# Altium project Digital_Azan_Clock.PrjPcb
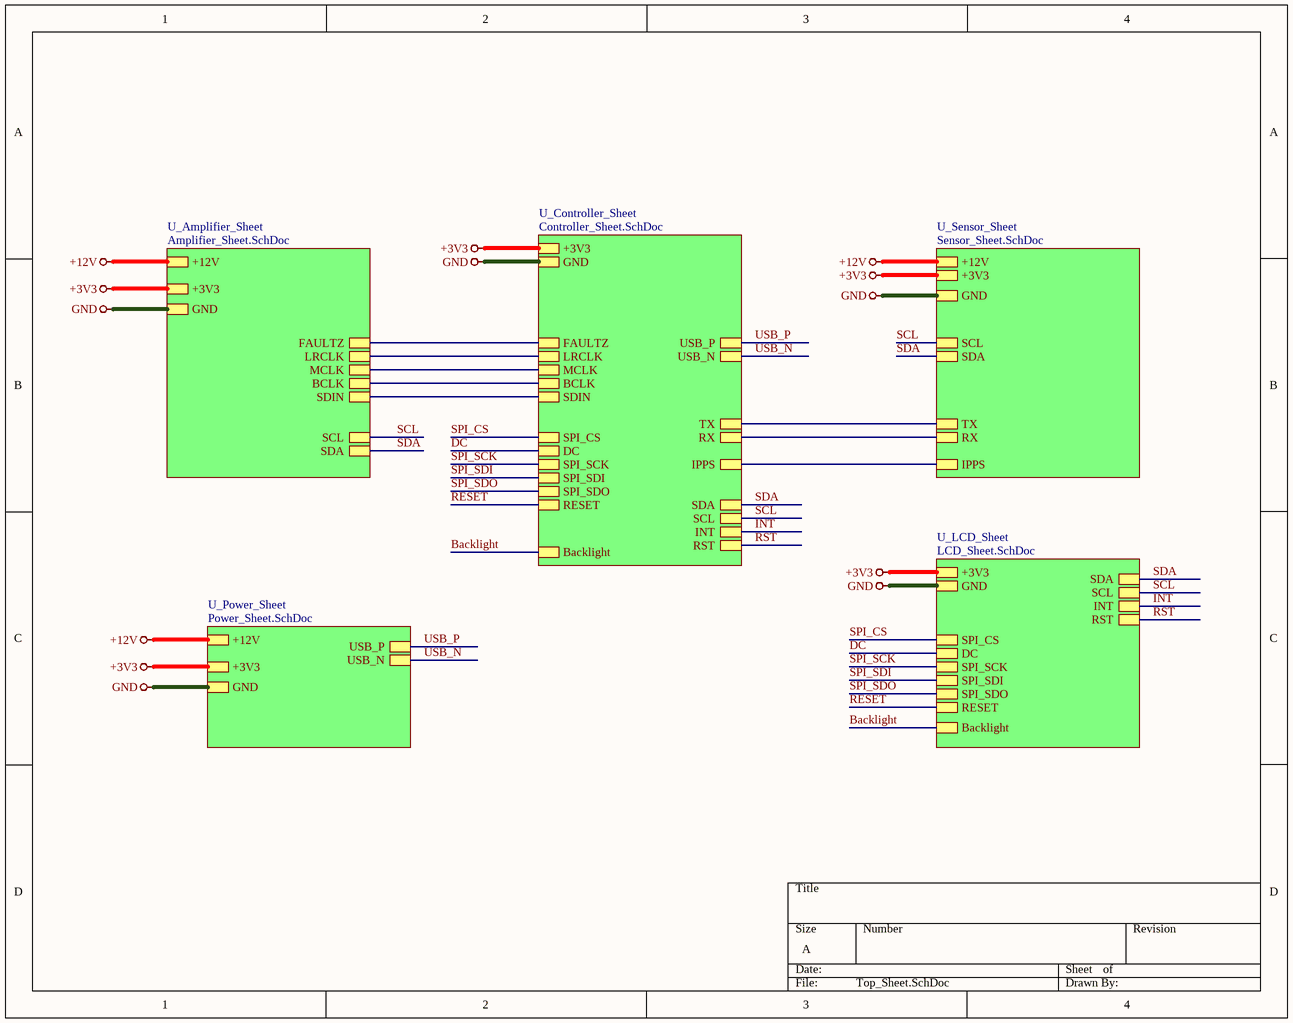
[diagram p0: Top_Sheet.SchDoc]
3 sheets, 41 parts. Net scope: hierarchical (ports join the sheet entries above them; power ports are global).
Board file: Clock-v1.0.PcbDoc
Sheets:
  Top_Sheet.SchDoc
    U_LCD_Sheet = LCD_Sheet.SchDoc
    U_Controller_Sheet = Controller_Sheet.SchDoc

## Sheet Top_Sheet.SchDoc
size A; SheetNumber: 1; SheetTotal: 6

### Sub-sheets
U_Amplifier_Sheet = Amplifier_Sheet.SchDoc (file not in this document): +12V, +3V3, GND, FAULTZ, LRCLK, MCLK, BCLK, SDIN, SCL, SDA
U_Controller_Sheet = Controller_Sheet.SchDoc: +3V3, GND, FAULTZ, LRCLK, MCLK, BCLK, SDIN, SCL, SDA, TX, RX, IPPS, USB_P, USB_N, SPI_CS, DC, SPI_SCK, SPI_SDI, SPI_SDO, RESET, Backlight, INT, RST
U_LCD_Sheet = LCD_Sheet.SchDoc: +3V3, GND, SPI_CS, DC, SPI_SCK, SPI_SDI, SPI_SDO, RESET, Backlight, SDA, SCL, INT, RST
U_Power_Sheet = Power_Sheet.SchDoc (file not in this document): +12V, GND, USB_P, USB_N, +3V3
U_Sensor_Sheet = Sensor_Sheet.SchDoc (file not in this document): +12V, +3V3, GND, SCL, SDA, TX, RX, IPPS

### Nets
+3V3: sheet U_Amplifier_Sheet/+3V3, sheet U_Power_Sheet/+3V3, sheet U_Sensor_Sheet/+3V3, sheet U_LCD_Sheet/+3V3, sheet U_Controller_Sheet/+3V3
+12V: sheet U_Amplifier_Sheet/+12V, sheet U_Power_Sheet/+12V, sheet U_Sensor_Sheet/+12V
GND: sheet U_Amplifier_Sheet/GND, sheet U_Power_Sheet/GND, sheet U_Sensor_Sheet/GND, sheet U_LCD_Sheet/GND, sheet U_Controller_Sheet/GND
Backlight: sheet U_LCD_Sheet/Backlight, sheet U_Controller_Sheet/Backlight
BCLK: sheet U_Amplifier_Sheet/BCLK, sheet U_Controller_Sheet/BCLK
DC: sheet U_LCD_Sheet/DC, sheet U_Controller_Sheet/DC
FAULTZ: sheet U_Amplifier_Sheet/FAULTZ, sheet U_Controller_Sheet/FAULTZ
INT: sheet U_LCD_Sheet/INT, sheet U_Controller_Sheet/INT
IPPS: sheet U_Sensor_Sheet/IPPS, sheet U_Controller_Sheet/IPPS
LRCLK: sheet U_Amplifier_Sheet/LRCLK, sheet U_Controller_Sheet/LRCLK
MCLK: sheet U_Amplifier_Sheet/MCLK, sheet U_Controller_Sheet/MCLK
RESET: sheet U_LCD_Sheet/RESET, sheet U_Controller_Sheet/RESET
RST: sheet U_LCD_Sheet/RST, sheet U_Controller_Sheet/RST
RX: sheet U_Sensor_Sheet/RX, sheet U_Controller_Sheet/RX
SCL: sheet U_Amplifier_Sheet/SCL, sheet U_Sensor_Sheet/SCL, sheet U_LCD_Sheet/SCL, sheet U_Controller_Sheet/SCL
SDA: sheet U_Amplifier_Sheet/SDA, sheet U_Sensor_Sheet/SDA, sheet U_LCD_Sheet/SDA, sheet U_Controller_Sheet/SDA
SDIN: sheet U_Amplifier_Sheet/SDIN, sheet U_Controller_Sheet/SDIN
SPI_CS: sheet U_LCD_Sheet/SPI_CS, sheet U_Controller_Sheet/SPI_CS
SPI_SCK: sheet U_LCD_Sheet/SPI_SCK, sheet U_Controller_Sheet/SPI_SCK
SPI_SDI: sheet U_LCD_Sheet/SPI_SDI, sheet U_Controller_Sheet/SPI_SDI
SPI_SDO: sheet U_LCD_Sheet/SPI_SDO, sheet U_Controller_Sheet/SPI_SDO
TX: sheet U_Sensor_Sheet/TX, sheet U_Controller_Sheet/TX
USB_N: sheet U_Power_Sheet/USB_N, sheet U_Controller_Sheet/USB_N
USB_P: sheet U_Power_Sheet/USB_P, sheet U_Controller_Sheet/USB_P

## Sheet LCD_Sheet.SchDoc
size A; SheetNumber: 6; SheetTotal: 6
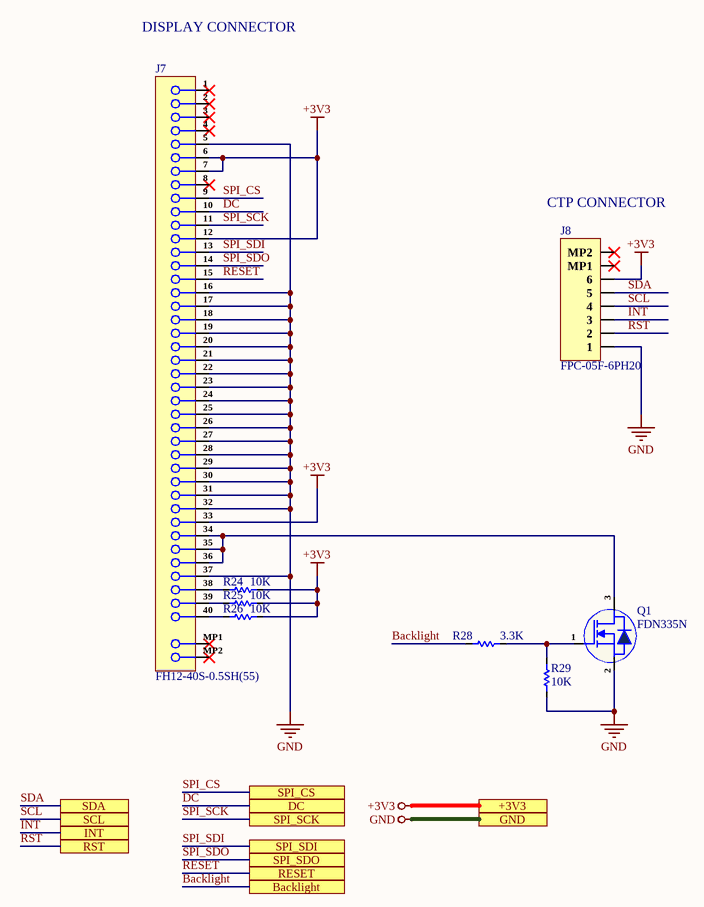
[diagram p1: LCD_Sheet.SchDoc]

### Parts
J7  FH12-40S-0.5SH(55)  [FH12-40S-0.5SH(55)]
J8  FPC-05F-6PH20  [FPC-05F-6PH20]
Q1  FDN335N  [SOT-23]
R24  10K  [Res-0603]
R25  10K  [Res-0603]
R26  10K  [Res-0603]
R28  3.3K  [Res-0603]
R29  10K  [Res-0603]

### Ports
+3V3 (see Top_Sheet[3C], Amplifier_Sheet[3D], Controller_Sheet[3D], Power_Sheet[3D], Sensor_Sheet[3D]), Backlight (see Top_Sheet[3C], Controller_Sheet[3D]), DC (see Top_Sheet[3C], Controller_Sheet[3D]), GND (see Top_Sheet[3C], Amplifier_Sheet[3D], Controller_Sheet[3D], Power_Sheet[3D], Sensor_Sheet[3D]), INT (see Top_Sheet[4C], Controller_Sheet[1D]), RESET (see Top_Sheet[3C], Controller_Sheet[3D]), RST (see Top_Sheet[4C], Controller_Sheet[1D]), SCL (see Top_Sheet[4C], Amplifier_Sheet[2D], Controller_Sheet[1D], Sensor_Sheet[2D]), SDA (see Top_Sheet[4C], Amplifier_Sheet[2D], Controller_Sheet[1D], Sensor_Sheet[2D]), SPI_CS (see Top_Sheet[3C], Controller_Sheet[3C]), SPI_SCK (see Top_Sheet[3C], Controller_Sheet[3D]), SPI_SDI (see Top_Sheet[3C], Controller_Sheet[3D]), SPI_SDO (see Top_Sheet[3C], Controller_Sheet[3D])

### Nets
+3V3: J7.6 J7.7 J7.12 J7.33 J8.6 R24.2 R25.2 R26.2 ; port +3V3
GND: J7.5 J7.16 J7.17 J7.18 J7.19 J7.20 J7.21 J7.22 J7.23 J7.24 J7.25 J7.26 J7.27 J7.28 J7.29 J7.30 J7.31 J7.32 J7.37 J8.1 Q1.2(S) R29.1 ; port GND
Backlight: R28.1 ; port Backlight
DC: J7.10 ; port DC
INT: J8.3 ; port INT
RESET: J7.15 ; port RESET
RST: J8.2 ; port RST
SCL: J8.4 ; port SCL
SDA: J8.5 ; port SDA
SPI_CS: J7.9 ; port SPI_CS
SPI_SCK: J7.11 ; port SPI_SCK
SPI_SDI: J7.13 ; port SPI_SDI
SPI_SDO: J7.14 ; port SPI_SDO
NetJ7_34: J7.34 J7.35 J7.36 Q1.3(D)
NetJ7_38: J7.38 R24.1
NetJ7_39: J7.39 R25.1
NetJ7_40: J7.40 R26.1
NetQ1_1: Q1.1(G) R28.2 R29.2

Not connected (* = marked no-connect by the designer): J7 1* 2* 3* 4* 8* MP1* MP2*; J8 MP1* MP2*

### Notes on the sheet
- DISPLAY CONNECTOR
- (near J8) CTP CONNECTOR

### Library data of the parts
J7 = FH12-40S-0.5SH(55): CONN FFC BOTTOM 40POS 0.50MM R/A; Manufacturer: Hirose; Connector Type: CARD EDGE CONNECTOR; Option: General Purpose; Filter Feature: No; Number of Rows Loaded: 1; Number of Contacts: 40; Contact Pattern: RECTANGULAR; Contact Resistance: 50mR; Contact Style: BELLOWED TYPE; Dielectric Withstanding Voltage (AC): 150V; Durability: 20Cycles; Insulation Resistance: 500MR; Rated Current (Signal): 400mA; Body Breadth: 0.079inch; Body Depth: 0.22inch; Body Length: 0.949inch; Mating Contact Pitch: 0.02inch; Mounting Option 1: EJECT LEVER; Mounting Option 2: LOCKING; Reference Standard: UL; Reliability: COMMERCIAL; Item Type: Connector; Supplier 1: Digi-Key; Manufacturer Part Number: FH12-40S-0.5SH(55); RoHS: Yes; Category: FFC / FPC; Stock 1: 11247; Pricing 1: 1=3.00000, 10=2.72800, 25=2.58400, 50=2.52400, 100=2.40380, 250=2.10332, 500=2.04324, 1000=1.74276 (USD); Mounting Technology: Board; Contact Finish - Mating: NOT SPECIFIED; Contact Finish - Termination: Nickel/Gold (Ni/Au); Insulation Color: Beige; Insulation Material: Polyamide; Min Operating Temperature: -40°C; Max Operating Temperature: 70°C; JESD-609 Code: e4; Contact Gender: Female; Mixed Contacts: No; Mounting Style: RIGHT ANGLE; Termination: SMD/SMT; Number Of PCB Rows: 1; PCB Contact Pattern: RECTANGULAR; Terminal Pitch: 0.5mm; Flammability Rating: UL94 V-0; RoHS Compliant: Yes; DIN Conformance: No; IEC Conformance: No; MIL Conformance: No; Reach SVHC Compliant: Yes; ComponentLink1URL: https://datasheet.ciiva.com:443/pdfs/VipMasterIC/IC/HIRO/HIRO-S-A0003089604/HIRO-S-A0008599618-1.pdf?src-supplier=IHS+Markit; ComponentLink1Description: https://datasheet.ciiva.com:443/pdfs/VipMasterIC/IC/HIRO/HIRO-S-A0003089604/HIRO-S-A0008599618-1.pdf?src-supplier=IHS+Markit; ComponentLink2URL: https://datasheet.ciiva.com/11745/0900766b80d985fc-11745617.pdf?src-supplier=RSComponents; ComponentLink2Description: https://datasheet.ciiva.com/11745/0900766b80d985fc-11745617.pdf?src-supplier=RSComponents; ComponentLink3URL: https://datasheet.ciiva.com/15176/getdatasheetpartid-432539-15176843.pdf?src-supplier=Verical; ComponentLink3Description: https://datasheet.ciiva.com/15176/getdatasheetpartid-432539-15176843.pdf?src-supplier=Verical; ComponentLink4URL: https://datasheet.ciiva.com/7661/58803-7661389.pdf?src-supplier=Element14; ComponentLink4Description: https://datasheet.ciiva.com/7661/58803-7661389.pdf?src-supplier=Element14; Supplier Part Number 1: 26-FH12-40S-0.5SH(55)CT-ND; LCSC Part Number: C202114
J8 = FPC-05F-6PH20: Clamshell -25℃~+85℃ 6P Bottom Contact Surface Mount，Right Angle 0.5mm SMD,P=0.5mm,Surface Mount，Right Angle FFC/FPC Connectors ROHS; Manufacturer: XUNPU; Item Type: FPC; Manufacturer Part Number: FPC-05F-6PH20; LCSC Part Number: C2856796; Package: SMD,P=0.5mm; ComponentLink1Description: LCSC Link; ComponentLink1URL: https://www.lcsc.com/product-detail/FFC-FPC-Connectors_XUNPU-FPC-05F-6PH20_C2856796.html
Q1 = FDN335N: SOT-23 MOSFETs ROHS; Manufacturer: TECH PUBLIC; Item Type: Mosfet; Manufacturer Part Number: FDN335N; Package: SOT-23; LCSC Part Number: C5123904; ComponentLink1Description: LCSC; ComponentLink1URL: https://www.lcsc.com/product-detail/MOSFETs_TECH-PUBLIC-FDN335N_C5123904.html
R24-R26 R29 = RT0603BRD0710KL: RES SMD 10K OHM 0.1% 1/10W 0603; Manufacturer: Yageo; Power: 100mW; Rated Temperature: 70°C; Value: 10kR; Temperature Coefficient: 25ppm/°C; Working Voltage: 75V; Package Height: 0.45mm; Package Length: 1.6mm; Package Width: 0.8mm; Item Type: Resistor; Supplier 1: Rs; Manufacturer Part Number: RT0603BRD0710KL; RoHS: Yes; Category: Chip SMD Resistors; Stock 1: 20510; Pricing 1: 100=0.29800, 250=0.27800, 500=0.25900, 1000=0.23700 (GBP); Mounting Technology: Surface Mount; Pins: 2; Case/Package: 0603; Min Operating Temperature: -55°C; Max Operating Temperature: 155°C; Tolerance: 0.1%; Resistor Type: FIXED RESISTOR; Construction: Chip; Package Style: SMTMeter; Packaging: Tape and Reel; Technology: THIN FILM; Termination: Wraparound; Reach SVHC Compliant: Yes; RoHS Compliant: Yes; ComponentLink1URL: https://datasheet.ciiva.com:443/pdfs/VipMasterIC/IC/YAGO/YAGO-S-A0008510989/YAGO-S-A0008510989-1.pdf?src-supplier=IHS+Markit; ComponentLink1Description: https://datasheet.ciiva.com:443/pdfs/VipMasterIC/IC/YAGO/YAGO-S-A0008510989/YAGO-S-A0008510989-1.pdf?src-supplier=IHS+Markit; ComponentLink2URL: https://datasheet.ciiva.com/5624/pyu-rt-1-to-0-05-rohs-l-4-5624351.pdf?src-supplier=Mouser; ComponentLink2Description: https://datasheet.ciiva.com/5624/pyu-rt-1-to-0-05-rohs-l-4-5624351.pdf?src-supplier=Mouser; ComponentLink3URL: https://datasheet.ciiva.com/29721/pyu-rt-1-to-0-05-rohs-l-4-29721177.pdf?src-supplier=Digi-Key; ComponentLink3Description: https://datasheet.ciiva.com/29721/pyu-rt-1-to-0-05-rohs-l-4-29721177.pdf?src-supplier=Digi-Key; Supplier Part Number 1: 1991391P; LCSC Part Number: C95204
R28 = 0603WAF3301T5E: 100mW Thick Film Resistors 75V ±100ppm/℃ ±1% 3.3kΩ 0603 Chip Resistor - Surface Mount ROHS; Manufacturer: UNI-ROYAL(Uniroyal Elec); Manufacturer Part Number: 0603WAF3301T5E; LCSC Part Number: C22978; Item Type: Resistor; Package: 0603; ComponentLink1Description: LSCS Link; ComponentLink1URL: https://www.lcsc.com/product-detail/Chip-Resistor-Surface-Mount_UNI-ROYAL-Uniroyal-Elec-0603WAF3301T5E_C22978.html

## Sheet Controller_Sheet.SchDoc
size A; SheetNumber: 3; SheetTotal: 6
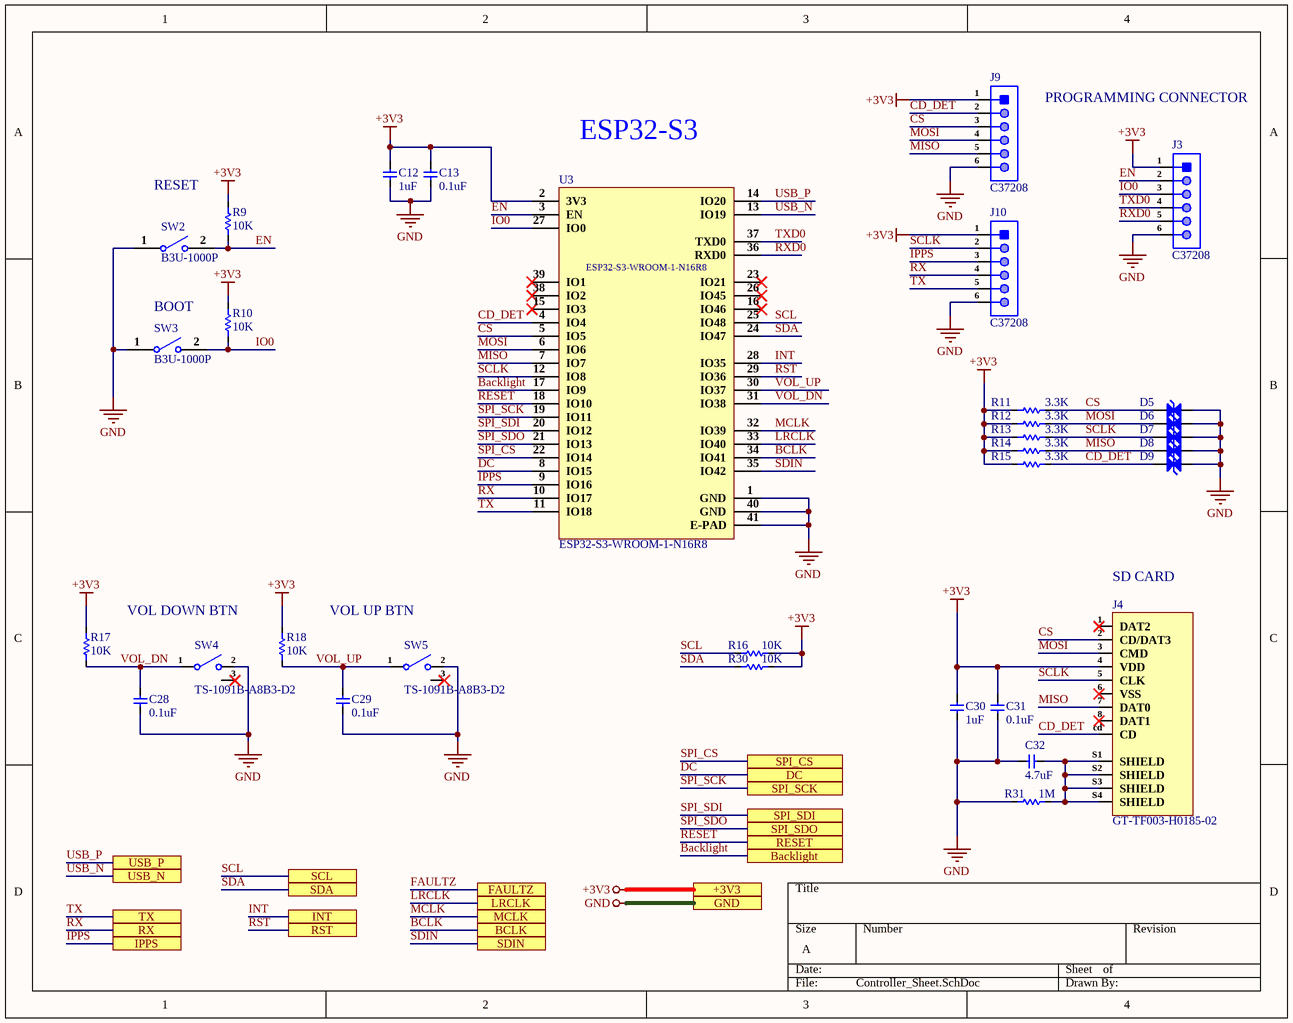
[diagram p2: Controller_Sheet.SchDoc]

### Parts
C12  1uF  [Cap-0603]
C13  0.1uF  [Cap-0603]
C28  0.1uF  [Cap-0603]
C29  0.1uF  [Cap-0603]
C30  1uF  [Cap-0603]
C31  0.1uF  [Cap-0603]
C32  4.7uF  [Cap-0603]
D5  ESD9X5VU  [DFN1006-2L_]  (value not drawn)
D6  ESD9X5VU  [DFN1006-2L_]  (value not drawn)
D7  ESD9X5VU  [DFN1006-2L_]  (value not drawn)
D8  ESD9X5VU  [DFN1006-2L_]  (value not drawn)
D9  ESD9X5VU  [DFN1006-2L_]  (value not drawn)
J3  C37208  [HDR1X6_]
J4  GT-TF003-H0185-02  [GT-TF003-H0185-02]
J9  C37208  [HDR1X6_]  (no BOM)
J10  C37208  [HDR1X6_]  (no BOM)
R9  10K  [Res-0603]
R10  10K  [Res-0603]
R11  3.3K  [Res-0603]
R12  3.3K  [Res-0603]
R13  3.3K  [Res-0603]
R14  3.3K  [Res-0603]
R15  3.3K  [Res-0603]
R16  10K  [Res-0603]
R17  10K  [Res-0603]
R18  10K  [Res-0603]
R30  10K  [Res-0603]
R31  1M  [Res-0402]
SW2  B3U-1000P  [B3U-1000P]
SW3  B3U-1000P  [B3U-1000P]
SW4  TS-1091B-A8B3-D2  [TS-1091B-A8B3-D2]
SW5  TS-1091B-A8B3-D2  [TS-1091B-A8B3-D2]
U3  ESP32-S3-WROOM-1-N16R8  [41-SMD Module]

### Ports
+3V3 (see Top_Sheet[2A], Amplifier_Sheet[3D], LCD_Sheet[3D], Power_Sheet[3D], Sensor_Sheet[3D]), Backlight (see Top_Sheet[2C], LCD_Sheet[2D]), BCLK (see Top_Sheet[2B], Amplifier_Sheet[2D]), DC (see Top_Sheet[2B], LCD_Sheet[2D]), FAULTZ (see Top_Sheet[2B], Amplifier_Sheet[2D]), GND (see Top_Sheet[2B], Amplifier_Sheet[3D], LCD_Sheet[3D], Power_Sheet[3D], Sensor_Sheet[3D]), INT (see Top_Sheet[3C], LCD_Sheet[1D]), IPPS (see Top_Sheet[3B], Sensor_Sheet[1D]), LRCLK (see Top_Sheet[2B], Amplifier_Sheet[2D]), MCLK (see Top_Sheet[2B], Amplifier_Sheet[2D]), RESET (see Top_Sheet[2B], LCD_Sheet[2D]), RST (see Top_Sheet[3C], LCD_Sheet[1D]), RX (see Top_Sheet[3B], Sensor_Sheet[1D]), SCL (see Top_Sheet[3C], Amplifier_Sheet[2D], LCD_Sheet[1D], Sensor_Sheet[2D]), SDA (see Top_Sheet[3B], Amplifier_Sheet[2D], LCD_Sheet[1D], Sensor_Sheet[2D]), SDIN (see Top_Sheet[2B], Amplifier_Sheet[2D]), SPI_CS (see Top_Sheet[2B], LCD_Sheet[2D]), SPI_SCK (see Top_Sheet[2B], LCD_Sheet[2D]), SPI_SDI (see Top_Sheet[2B], LCD_Sheet[2D]), SPI_SDO (see Top_Sheet[2B], LCD_Sheet[2D]), TX (see Top_Sheet[3B], Sensor_Sheet[1D]), USB_N (see Top_Sheet[3B], Power_Sheet[2D]), USB_P (see Top_Sheet[3B], Power_Sheet[2D])

### Nets
+3V3: C12.2 C13.2 C30.2 C31.2 J3.1 J4.4(VDD) J9.1 J10.1 R9.2 R10.2 R11.1 R12.1 R13.1 R14.1 R15.1 R16.1 R17.2 R18.2 R30.1 U3.2(3V3) ; port +3V3
GND: C12.1 C13.1 C28.1 C29.1 C30.1 C31.1 C32.2 D5.2(A) D6.2(A) D7.2(A) D8.2(A) D9.2(A) J3.6 J9.6 J10.6 R31.2 SW2.1 SW3.1 SW4.2 SW5.2 U3.1(GND) U3.40(GND) U3.41(E-PAD) ; port GND
Backlight: U3.17(IO9) ; port Backlight
BCLK: U3.34(IO41) ; port BCLK
CD_DET: D9.1(A) J4.cd(CD) J9.2 R15.2 U3.4(IO4)
CS: D5.1(A) J4.2(CD/DAT3) J9.3 R11.2 U3.5(IO5)
DC: U3.8(IO15) ; port DC
EN: J3.2 R9.1 SW2.2 U3.3(EN)
INT: U3.28(IO35) ; port INT
IO0: J3.3 R10.1 SW3.2 U3.27(IO0)
IPPS: J10.3 U3.9(IO16) ; port IPPS
LRCLK: U3.33(IO40) ; port LRCLK
MCLK: U3.32(IO39) ; port MCLK
MISO: D8.1(A) J4.7(DAT0) J9.5 R14.2 U3.7(IO7)
MOSI: D6.1(A) J4.3(CMD) J9.4 R12.2 U3.6(IO6)
RESET: U3.18(IO10) ; port RESET
RST: U3.29(IO36) ; port RST
RX: J10.4 U3.10(IO17) ; port RX
RXD0: J3.5 U3.36(RXD0)
SCL: R16.2 U3.25(IO48) ; port SCL
SCLK: D7.1(A) J4.5(CLK) J10.2 R13.2 U3.12(IO8)
SDA: R30.2 U3.24(IO47) ; port SDA
SDIN: U3.35(IO42) ; port SDIN
SPI_CS: U3.22(IO14) ; port SPI_CS
SPI_SCK: U3.19(IO11) ; port SPI_SCK
SPI_SDI: U3.20(IO12) ; port SPI_SDI
SPI_SDO: U3.21(IO13) ; port SPI_SDO
TX: J10.5 U3.11(IO18) ; port TX
TXD0: J3.4 U3.37(TXD0)
USB_N: U3.13(IO19) ; port USB_N
USB_P: U3.14(IO20) ; port USB_P
VOL_DN: C28.2 R17.1 SW4.1 U3.31(IO38)
VOL_UP: C29.2 R18.1 SW5.1 U3.30(IO37)
NetC32_1: C32.1 J4.S1(SHIELD) J4.S2(SHIELD) J4.S3(SHIELD) J4.S4(SHIELD) R31.1

Not connected (* = marked no-connect by the designer): J4 1(DAT2)* 6(VSS)* 8(DAT1)*; SW4 3*; SW5 3*; U3 15(IO3)* 16(IO46)* 23(IO21)* 26(IO45)* 38(IO2)* 39(IO1)*

### Notes on the sheet
- PROGRAMMING CONNECTOR
- ESP32-S3
- RESET
- BOOT
- VOL DOWN BTN
- VOL UP BTN
- (near J4) SD CARD

### Library data of the parts
C12 C30 = CC0603KRX5R8BB105: CAP CER 1UF 25V X5R 0603; Manufacturer: Yageo; Tolerance: 10%; Item Type: Capacitor; Supplier 1: Digi-Key; Manufacturer Part Number: CC0603KRX5R8BB105; RoHS: Yes; Category: Ceramic Capacitors; Stock 1: 919939; Pricing 1: 1=0.12000, 10=0.08400, 50=0.04760, 100=0.03940, 500=0.02764, 1000=0.02288 (USD); Mount: Surface Mount; Case/Package: 0603; Number of Pins: 2; Case Code (Metric): 1608; Case Code (Imperial): 0603; Min Operating Temperature: -55°C; Max Operating Temperature: 85°C; Capacitance: 1uF; Dielectric: X5R; Package Quantity: 1; Voltage Rating: 25V; Packaging: Tape and Reel; Termination: SMD/SMT; Voltage Rating (DC): 25V; Series: CC; Construction: Flat; Length: 1.6mm; Width: 0.031inch; Height: 0.8mm; Thickness: 0.035inch; Depth: 0.8mm; Radiation Hardening: No; REACH SVHC: No SVHC; Lead Free: Lead Free; Halogen Free: Halogen Free; RoHS Compliant: Yes; ComponentLink1URL: https://datasheet.ciiva.com/176/mlccorderingcode-176785.pdf?src-supplier=Digi-Key; ComponentLink1Description: https://datasheet.ciiva.com/176/mlccorderingcode-176785.pdf?src-supplier=Digi-Key; ComponentLink2URL: https://datasheet.ciiva.com/176/mlccorderingcode-176786.pdf?src-supplier=Digi-Key; ComponentLink2Description: https://datasheet.ciiva.com/176/mlccorderingcode-176786.pdf?src-supplier=Digi-Key; ComponentLink3URL: https://datasheet.ciiva.com/176/mlccorderingcode-176787.pdf?src-supplier=Digi-Key; ComponentLink3Description: https://datasheet.ciiva.com/176/mlccorderingcode-176787.pdf?src-supplier=Digi-Key; ComponentLink4URL: https://datasheet.ciiva.com/17436/upy-gphc-x5r-4v-to-50v-12-17436952.pdf?src-supplier=Avnet+Europe; ComponentLink4Description: https://datasheet.ciiva.com/17436/upy-gphc-x5r-4v-to-50v-12-17436952.pdf?src-supplier=Avnet+Europe; ComponentLink5URL: https://datasheet.ciiva.com/7978/1525783-7978171.pdf?src-supplier=Element14; ComponentLink5Description: https://datasheet.ciiva.com/7978/1525783-7978171.pdf?src-supplier=Element14; ComponentLink6URL: https://datasheet.ciiva.com/11586/upy-gphc-x5r-4v-to-50v-12-11586318.pdf?src-supplier=Avnet; ComponentLink6Description: https://datasheet.ciiva.com/11586/upy-gphc-x5r-4v-to-50v-12-11586318.pdf?src-supplier=Avnet; Supplier Part Number 1: 311-1445-1-ND; LCSC Part Number: C14664
C13 C28 C29 C31 = CC0603KRX7R0BB104: CAP CER 0.1UF 100V X7R 0603; Manufacturer: Yageo; Capacitance: 100nF; Tolerance: 10%; Item Type: Capacitor; Supplier 1: Digi-Key; Manufacturer Part Number: CC0603KRX7R0BB104; RoHS: Yes; Category: Ceramic Capacitors; Stock 1: 60476; Pricing 1: 1=0.19000, 10=0.13500, 50=0.07680, 100=0.06370, 500=0.04466, 1000=0.03696 (USD); Mount: Surface Mount; Case/Package: 0603; Case Code (Metric): 1608; Case Code (Imperial): 0603; Weight: 7.1E-05oz; Min Operating Temperature: -55°C; Max Operating Temperature: 125°C; Package Quantity: 4000; Voltage Rating: 100V; Packaging: Tape and Reel; Dielectric: X7R; Termination: SMD/SMT; Resistor Type: Ceramic; Voltage Rating (DC): 100V; Series: CC; Length: 0.063inch; Width: 0.031inch; Thickness: 0.035inch; Depth: 0.8mm; Lead Free: Lead Free; RoHS Compliant: Yes; ComponentLink1URL: https://datasheet.ciiva.com/6277/mlccorderingcode-6277030.pdf?src-supplier=Digi-Key; ComponentLink1Description: https://datasheet.ciiva.com/6277/mlccorderingcode-6277030.pdf?src-supplier=Digi-Key; ComponentLink2URL: https://datasheet.ciiva.com/6277/mlccorderingcode-6277081.pdf?src-supplier=Digi-Key; ComponentLink2Description: https://datasheet.ciiva.com/6277/mlccorderingcode-6277081.pdf?src-supplier=Digi-Key; ComponentLink3URL: https://datasheet.ciiva.com/6277/mlccorderingcode-6277082.pdf?src-supplier=Digi-Key; ComponentLink3Description: https://datasheet.ciiva.com/6277/mlccorderingcode-6277082.pdf?src-supplier=Digi-Key; Supplier Part Number 1: 311-1523-1-ND; LCSC Part Number: C113803
C32 = CC0603KRX7R9BB472: 50V 4.7nF X7R ±10% 0603 Multilayer Ceramic Capacitors MLCC - SMD/SMT ROHS; Manufacturer: YAGEO; Manufacturer Part Number: CC0603KRX7R9BB472; LCSC Part Number: C106218; Item Type: Capacitor; Package: 0603; ComponentLink1Description: LCSC Link; ComponentLink1URL: https://www.lcsc.com/product-detail/Multilayer-Ceramic-Capacitors-MLCC-SMD-SMT_YAGEO-CC0603KRX7R9BB472_C106218.html
D5-D9 = ESD9X5VU: DFN1006-2 ESD Protection Devices ROHS; Manufacturer: TECH PUBLIC; Manufacturer Part Number: ESD9X5VU; Footprint: DFN1006-2; ComponentLink1Description: LCSC; ComponentLink1URL: https://www.lcsc.com/product-detail/span-style-background-color-ff0-ESD-span-Protection-Devices_TECH-PUBLIC-ESD9X5VU_C2875160.html; LCSC Part Number: C2875160
J3 J9 J10 = C37208: Straight 1 6 2.54mm Black Brass Plugin,P=2.54mm Pin Headers ROHS; Manufacturer: BOOMELEC; Item Type: Header; Manufacturer Part Number: C37208; Package: Custom; ComponentLink1Description: New link; ComponentLink1URL: https://www.lcsc.com/product-detail/Pin-Headers_BOOMELE-Boom-Precision-Elec-C37208_C37208.html; LCSC Part Number: C37208
J4 = GT-TF003-H0185-02: -40℃~+90℃ 1.85mm Gold plating Deck MicroSD card (TF card) High Conductivity Copper Self bomb SMD SD Card Connectors ROHS; Manufacturer: G-Switch; Manufacturer Part Number: GT-TF003-H0185-02; Package: SMD; LCSC Part Number: C5155564; Item Type: MicroSD card; ComponentLink1Description: LCSC; ComponentLink1URL: https://www.lcsc.com/product-detail/SD-Card-Connectors_G-Switch-GT-TF003-H0185-02_C5155564.html
R9 R10 R16-R18 R30 = RT0603BRD0710KL: as R24 on sheet LCD_Sheet; Supplier 1: Rs; Manufacturer Part Number: RT0603BRD0710KL; RoHS: Yes; Category: Chip SMD Resistors; Stock 1: 20510; Pricing 1: 100=0.29800, 250=0.27800, 500=0.25900, 1000=0.23700 (GBP); Mounting Technology: Surface Mount; Pins: 2; Case/Package: 0603; Min Operating Temperature: -55°C; Max Operating Temperature: 155°C; Tolerance: 0.1%; Resistor Type: FIXED RESISTOR; Construction: Chip; Package Style: SMTMeter; Packaging: Tape and Reel; Technology: THIN FILM; Termination: Wraparound; Reach SVHC Compliant: Yes; RoHS Compliant: Yes; ComponentLink1URL: https://datasheet.ciiva.com:443/pdfs/VipMasterIC/IC/YAGO/YAGO-S-A0008510989/YAGO-S-A0008510989-1.pdf?src-supplier=IHS+Markit; ComponentLink1Description: https://datasheet.ciiva.com:443/pdfs/VipMasterIC/IC/YAGO/YAGO-S-A0008510989/YAGO-S-A0008510989-1.pdf?src-supplier=IHS+Markit; ComponentLink2URL: https://datasheet.ciiva.com/5624/pyu-rt-1-to-0-05-rohs-l-4-5624351.pdf?src-supplier=Mouser; ComponentLink2Description: https://datasheet.ciiva.com/5624/pyu-rt-1-to-0-05-rohs-l-4-5624351.pdf?src-supplier=Mouser; ComponentLink3URL: https://datasheet.ciiva.com/29721/pyu-rt-1-to-0-05-rohs-l-4-29721177.pdf?src-supplier=Digi-Key; ComponentLink3Description: https://datasheet.ciiva.com/29721/pyu-rt-1-to-0-05-rohs-l-4-29721177.pdf?src-supplier=Digi-Key; Supplier Part Number 1: 1991391P; LCSC Part Number: C95204
R11-R15 = 0603WAF3301T5E: as R28 on sheet LCD_Sheet; Manufacturer Part Number: 0603WAF3301T5E; LCSC Part Number: C22978; Item Type: Resistor; Package: 0603; ComponentLink1Description: LSCS Link; ComponentLink1URL: https://www.lcsc.com/product-detail/Chip-Resistor-Surface-Mount_UNI-ROYAL-Uniroyal-Elec-0603WAF3301T5E_C22978.html
R31 = AF0402JR-071ML: RES SMD 1M OHM 5% 1/16W 0402; Manufacturer: Yageo; Resistance: 1MR; Max Power Dissipation: 63mW; Temperature Coefficient: 100ppm/°C; Item Type: Resistor; Supplier 1: Digi-Key; Manufacturer Part Number: AF0402JR-071ML; Stock 1: 0; Pricing 1: 10000=0.00408 (USD); Case/Package: 0402; Min Operating Temperature: -55°C; Max Operating Temperature: 155°C; Packaging: Tape and Reel; Resistor Type: Thick Film; Number of Terminations: 2; Tolerance: 5%; Features: Moisture Resistant,Anti-Sulfur; Length: 0.039inch; Width: 0.02inch; Height: 0.015inch; RoHS Compliant: Yes; ComponentLink1URL: https://www.yageo.com/upload/media/product/productsearch/datasheet/rchip/PYu-AF_51_RoHS_L_6.pdf?src-supplier=Digi-Key; ComponentLink1Description: https://www.yageo.com/upload/media/product/productsearch/datasheet/rchip/PYu-AF_51_RoHS_L_6.pdf?src-supplier=Digi-Key; Supplier Part Number 1: AF0402JR-071ML-ND; LCSC Part Number: C144054
SW2 SW3 = B3U-1000P: SWITCH TACTILE SPST-NO 0.05A 12V; Manufacturer: Omron; Mechanical Life: 200000Cycles; Operating Force: 1.5N; Throw Configuration: SPST; Current Rating: 50mA; Contact Resistance: 100mR; Illumination Type: Non-Illuminated,Illuminated; Switch Travel: 0.15mm; Switch Function: Off-Mom; Actuator Type: Standard; Actuator Length: 0.4mm; Ratings: Dust Proof,IP40; ComponentLink1URL: http://www.farnell.com/datasheets/60838.pdf?src-supplier=Farnell; ComponentLink1Description: http://www.farnell.com/datasheets/60838.pdf?src-supplier=Farnell; ComponentLink2URL: http://www.farnell.com/datasheets/60838.pdf?src-supplier=Element14; ComponentLink2Description: http://www.farnell.com/datasheets/60838.pdf?src-supplier=Element14; ComponentLink3URL: https://omronfs.omron.com/en_US/ecb/products/pdf/en-b3u.pdf?src-supplier=Digi-Key; ComponentLink3Description: https://omronfs.omron.com/en_US/ecb/products/pdf/en-b3u.pdf?src-supplier=Digi-Key; ComponentLink4URL: http://www.omron.com/ecb/products/pdf/en-b3u.pdf?src-supplier=Digi-Key; ComponentLink4Description: http://www.omron.com/ecb/products/pdf/en-b3u.pdf?src-supplier=Digi-Key; ComponentLink5URL: https://www.distrelec.biz/Web/Downloads/he/et/B3U_eng_datasheet.pdf?mime=application%2Fpdf&src-supplier=Distrelec; ComponentLink5Description: https://www.distrelec.biz/Web/Downloads/he/et/B3U_eng_datasheet.pdf?mime=application%2Fpdf&src-supplier=Distrelec; ComponentLink6URL: http://www.onlinecomponents.com/productFiles/mf-OM/en-b3u.pdf?src-supplier=Onlinecomponents.com; ComponentLink6Description: http://www.onlinecomponents.com/productFiles/mf-OM/en-b3u.pdf?src-supplier=Onlinecomponents.com; Supplier 1: Digi-Key; Manufacturer Part Number: B3U-1000P; Stock 1: 116454; Pricing 1: 1=1, 10=0.961, 25=0.9064, 50=0.7976, 100=0.7251, 250=0.68888, 500=0.67074, 1000=0.52571 (USD); Mount: Surface Mount; Weight: 0.000776oz; Contact Material: Silver; Min Operating Temperature: -25°C; Max Operating Temperature: 70°C; Packaging: Tape and Reel; Voltage Rating (DC): 12V; Package Quantity: 1; Max Current Rating: 50mA; Termination: SMD/SMT; Orientation: Straight; Max Voltage Rating (DC): 12V; Electrical Life: 200000Cycles; Insulation Resistance: 100MR; Contact Current Rating: 50mA; Length: 4mm; Height: 1.2mm; Depth: 2.5mm; Width: 3mm; REACH SVHC: Unknown; Lead Free: Lead Free; ComponentLink7URL: https://www.verical.com/server-webapp/html/getDatasheet?partID=552554&src-supplier=Verical; ComponentLink7Description: https://www.verical.com/server-webapp/html/getDatasheet?partID=552554&src-supplier=Verical; ComponentLink8URL: http://www.farnell.com/datasheets/1685550.pdf?src-supplier=Element14; ComponentLink8Description: http://www.farnell.com/datasheets/1685550.pdf?src-supplier=Element14; ComponentLink9URL: http://www.farnell.com/datasheets/2610940.pdf?src-supplier=Farnell; ComponentLink9Description: http://www.farnell.com/datasheets/2610940.pdf?src-supplier=Farnell; ComponentLink10URL: https://www.alliedelec.com/m/d/4c8a9ef82804fc3c241a13c1e298fd73.pdf?src-supplier=Allied+Electronics; ComponentLink10Description: https://www.alliedelec.com/m/d/4c8a9ef82804fc3c241a13c1e298fd73.pdf?src-supplier=Allied+Electronics; Supplier Part Number 1: SW1020DKR-ND; LCSC Part Number: C231329; Item Type: Switch
SW4 SW5 = TS-1091B-A8B3-D2: NO Lying SPST 250gf@±30gf Plugin Tactile Switches ROHS; Manufacturer: Yuandi; Manufacturer Part Number: TS-1091B-A8B3-D2; Package: Plugin; LCSC Part Number: C557914; Item Type: Tactile Switch; ComponentLink1Description: LCSC; ComponentLink1URL: https://www.lcsc.com/product-detail/Tactile-Switches_Yuandi-TS-1091B-A8B3-D2_C557914.html
U3 = ESP32-S3-WROOM-1-N16R8: ESP32-S3 chip 2.4GHz SMD,18x25.5mm WiFi Modules ROHS; Manufacturer: Expressif System; Manufacturer Part Number: ESP32-S3-WROOM-1-N8; Item Type: IC; Package: SMD,18x25.5mm; LCSC Part Number: C2913198; ComponentLink1URL: https://www.lcsc.com/product-detail/WiFi-Modules_Espressif-Systems-ESP32-S3-WROOM-1-N8_C2913198.html; ComponentLink1Description: LCSC

## Nets that join several sheets
+3V3: LCD_Sheet (8 pins), Controller_Sheet (20 pins)
GND: LCD_Sheet (22 pins), Controller_Sheet (23 pins)
Backlight: LCD_Sheet (R28.1), Controller_Sheet (U3.17)
DC: LCD_Sheet (J7.10), Controller_Sheet (U3.8)
INT: LCD_Sheet (J8.3), Controller_Sheet (U3.28)
RESET: LCD_Sheet (J7.15), Controller_Sheet (U3.18)
RST: LCD_Sheet (J8.2), Controller_Sheet (U3.29)
SCL: LCD_Sheet (J8.4), Controller_Sheet (R16.2 U3.25)
SDA: LCD_Sheet (J8.5), Controller_Sheet (R30.2 U3.24)
SPI_CS: LCD_Sheet (J7.9), Controller_Sheet (U3.22)
SPI_SCK: LCD_Sheet (J7.11), Controller_Sheet (U3.19)
SPI_SDI: LCD_Sheet (J7.13), Controller_Sheet (U3.20)
SPI_SDO: LCD_Sheet (J7.14), Controller_Sheet (U3.21)